# Altium schematic sheet 2_CurrentSense.SchDoc
size A4; SheetNumber: 2; SheetTotal: 2
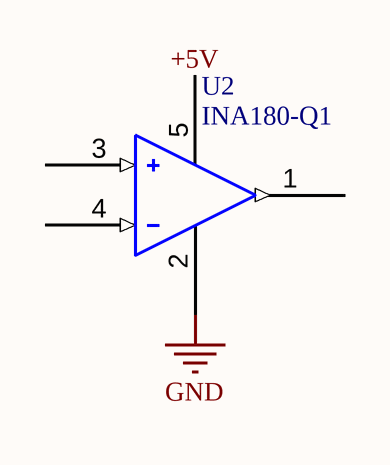
[diagram p0: 2_CurrentSense.SchDoc]

## Parts
U2  INA180-Q1  [SOT95P280X145-5N]

## Nets
GND: U2.2(GND)
+5V: U2.5(VS)

Not connected (* = marked no-connect by the designer): U2 1(OUT) 3(IN+) 4(IN-)

## Library data of the parts
U2 = INA180-Q1: Current Sense Amplifier